# EAGLE design 4HP_2181_VCA (EAGLE 8.1.1)
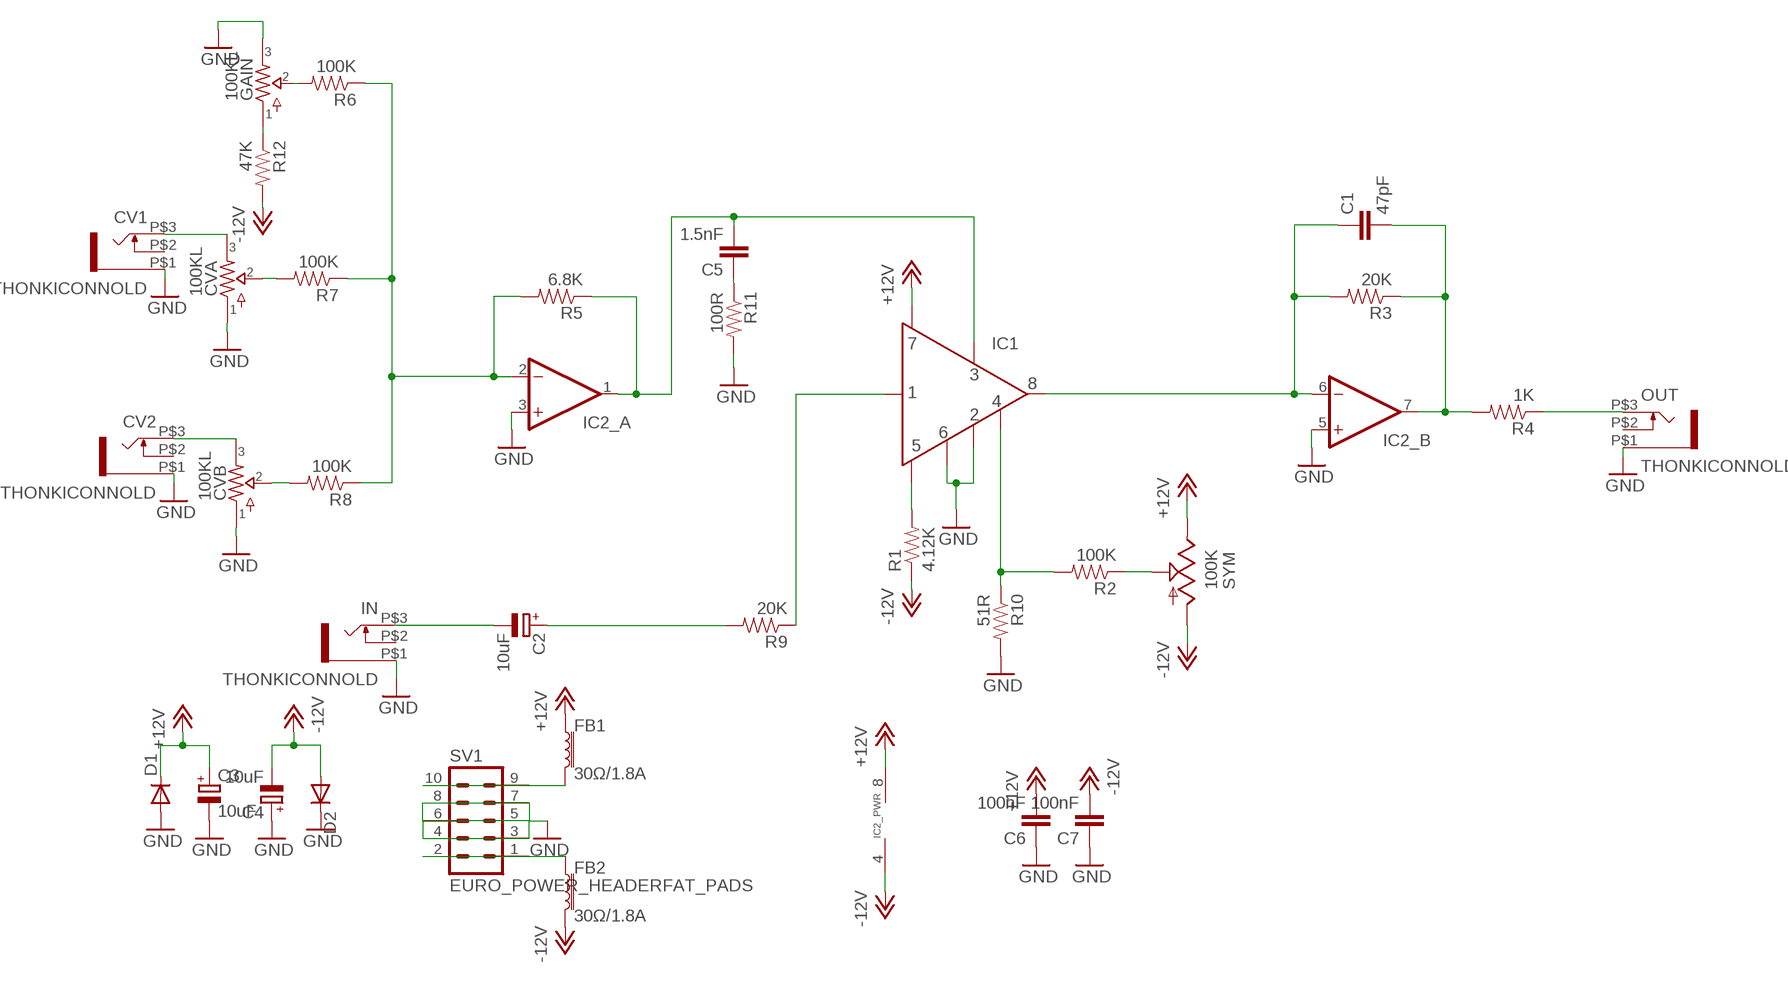
[diagram p0: schematic, sheet 1]

## Parts
C1  47pF  CAP0603-CAP  [0603-CAP]
C2  10uF  CAPACITOR_POL-CASE_B  [CASE_B]
C3  10uF  CAPACITOR_POL-CASE_B  [CASE_B]
C4  10uF  CAPACITOR_POL-CASE_B  [CASE_B]
C5  1.5nF  CAP0603-CAP  [0603-CAP]
C6  100nF  CAP0603-CAP  [0603-CAP]
C7  100nF  CAP0603-CAP  [0603-CAP]
CV1  THONKICONNOLD  [THONKICONN]
CV2  THONKICONNOLD  [THONKICONN]
CVA  100KL  POTS9MM_MOUNTED_2MMH  [9MM_W/MOUNTS-2MMHOLES]
CVB  100KL  POTS9MM_MOUNTED_2MMH  [9MM_W/MOUNTS-2MMHOLES]
D1  DIODE-SOD-123  [SOD-123]
D2  DIODE-SOD-123  [SOD-123]
FB1  30Ω/1.8A  FERRITE_BEAD-0603  [0603]
FB2  30Ω/1.8A  FERRITE_BEAD-0603  [0603]
GAIN  100KL  POTS9MM_MOUNTED_2MMH  [9MM_W/MOUNTS-2MMHOLES]
IC1  THAT2181C  [SIL8]
IC2  DUALSMD  [SO08]
IN  THONKICONNOLD  [THONKICONN]
OUT  THONKICONNOLD  [THONKICONN]
R1  4.12K  RESISTOR0603-RES  [0603-RES]
R2  100K  RESISTOR0603-RES  [0603-RES]
R3  20K  RESISTOR0603-RES  [0603-RES]
R4  1K  RESISTOR0603-RES  [0603-RES]
R5  6.8K  RESISTOR0603-RES  [0603-RES]
R6  100K  RESISTOR0603-RES  [0603-RES]
R7  100K  RESISTOR0603-RES  [0603-RES]
R8  100K  RESISTOR0603-RES  [0603-RES]
R9  20K  RESISTOR0603-RES  [0603-RES]
R10  51R  RESISTOR0603-RES  [0603-RES]
R11  100R  RESISTOR0603-RES  [0603-RES]
R12  47K  RESISTOR0603-RES  [0603-RES]
SV1  EURO_POWER_HEADERFAT_PADS  [EURO_PWR_HEADER_FAT]
SYM  100K  TRIM_US-S64W  [S64W]

## Nets
+12V: C3.+ C6.2 D1.C FB1.1 IC1.7 IC2.8(_PWR:V+) SYM.E
-12V: C4.- C7.2 D2.A FB2.2 IC2.4(_PWR:V-) R1.1 R12.2 SYM.A
GND: C3.- C4.+ C6.1 C7.1 CV1.P$1 CV2.P$1 CVA.P$1 CVB.P$1 D1.A D2.C GAIN.P$3 IC1.2 IC1.6 IC2.3(_A:+IN) IC2.5(_B:+IN) IN.P$1 OUT.P$1 R10.2 R11.2 SV1.3 SV1.4 SV1.5 SV1.6 SV1.7 SV1.8
N$1: C1.1 IC1.8 IC2.6(_B:-IN) R3.2
N$2: C5.2 IC1.3 IC2.1(_A:OUT) R5.1
N$3: IC1.5 R1.2
N$4: C1.2 IC2.7(_B:OUT) R3.1 R4.2
N$5: IC1.4 R2.2 R10.1
N$6: R2.1 SYM.S
N$7: OUT.P$3 R4.1
N$8: GAIN.P$2 R6.2
N$9: CVA.P$2 R7.2
N$10: CVB.P$2 R8.2
N$11: IC2.2(_A:-IN) R5.2 R6.1 R7.1 R8.1
N$12: C2.+ R9.2
N$13: C2.- IN.P$3
N$14: IC1.1 R9.1
N$15: CV1.P$3 CVA.P$3
N$16: CV2.P$3 CVB.P$3
N$17: FB1.2 SV1.9 SV1.10
N$18: FB2.1 SV1.1 SV1.2
N$19: C5.1 R11.1
N$20: GAIN.P$1 R12.1
Unconnected: CV1.P$2 CV2.P$2 IN.P$2 OUT.P$2

## Library data of the parts
C1 C5-C7 = SparkFun-Passives:CAP: Capacitor Standard 0603 ceramic capacitor, and 0.1" leaded capacitor.
C2-C4 = dp_devices:CAPACITOR_POL: Polarized capacitor in various packages
CV1 CV2 IN OUT = MusicThingModular:THONKICONN: 3.5mm socket for Eurorack modular synths
CVA CVB GAIN = potentiometers:POTS
D1 D2 = dp_devices:DIODE: Various Diode Packages
FB1 FB2 = SparkFun-Coils:FERRITE_BEAD: Ferrite Bead (blocks, cores, rings, chokes, etc.) Inductor with layers of ferrite used to suppress high frequencies. Often used to isolate high frequency noise. SparkFun Products: IOIO-OTG - V2.2 <https://www.sparkfun.com/products/13613> SparkFun SAMD21 Mini Breakout <https://www.sparkfun.com/products/13664> SparkFun 6 Degrees of Freedom Breakout - LSM6DS3 <https://www.sparkfun.com/products/13339> SparkFun SAMD21 Dev Breakout <https://www.sparkfun.com/products/13672>; PROD_ID: NDUC-07859
IC1 = integrated circuits:THAT2181C
IC2 = integrated circuits:DUAL: OP AMP
R1-R12 = SparkFun-Passives:RESISTOR: Resistor Basic schematic elements and footprints for 0603, 1206, and PTH resistors.
SV1 = MusicThingModular:EURO_POWER_HEADER: Power Header 10 pin power header for Eurorack Power Supplies Variants with fatter pads for easier soldering, and the LOCK variant which has 5mil offset pins to hold the component in place before soldering
SYM = pot:TRIM_US-: POTENTIOMETER

## Board
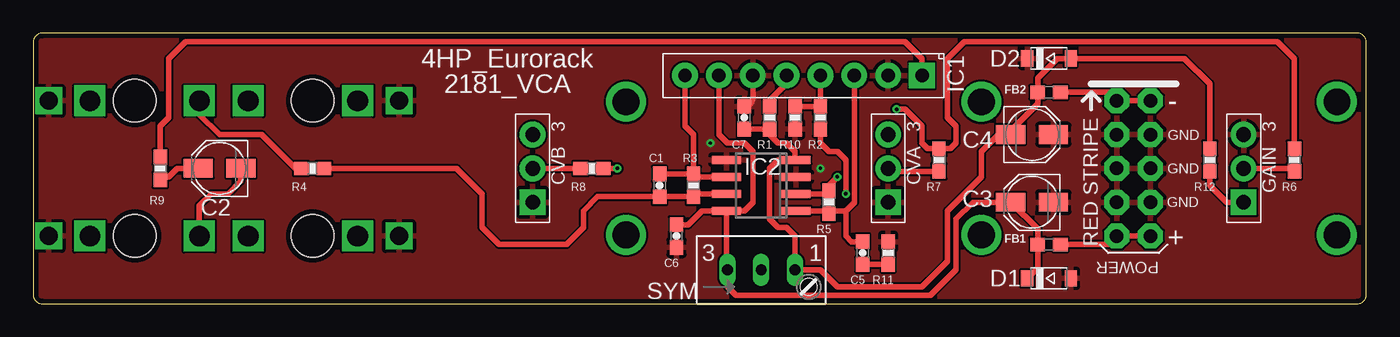
[diagram p1: board, top side]
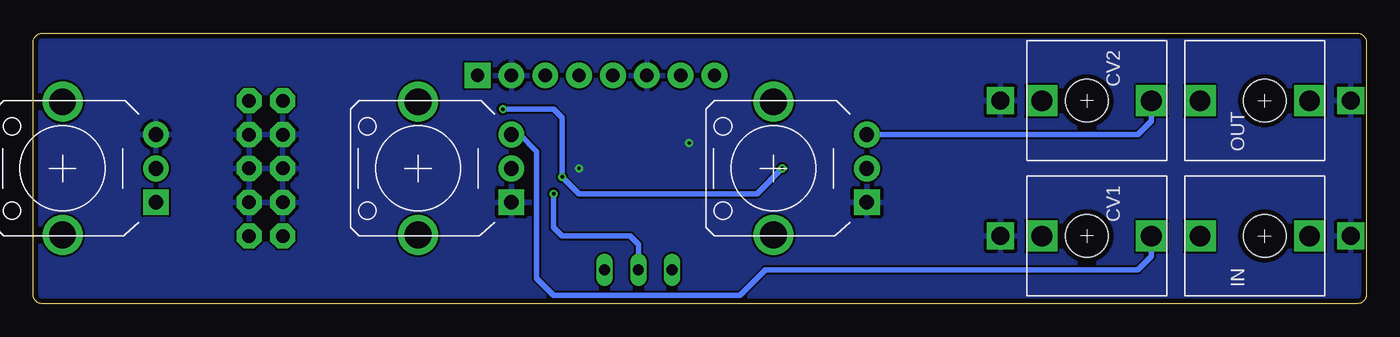
[diagram p2: board, bottom side, seen from below]

Size 100 x 20.31 mm. Coordinates in mm from the lower left corner, seen from the top.
Outline: 0,19.68 0,0.64 arc90 0.64,0 99.36,0 arc90 100,0.64 100,19.68 arc90 99.36,20.31 0.64,20.31 arc90 0,19.68
Copper layers (1*16): Top 0.0356mm / dielectric 1.5011mm / Bottom 0.0356mm
Design rules "LaenPCBOrder": minimum track width 6mil, minimum drill 13mil, track to track 6mil, track to pad 6mil, pad to pad 6mil, via to via 6mil, smd to smd 6mil, copper to edge 15mil, drill to drill 6mil, minimum pad ring 7mil, minimum via ring 7mil, stop-mask expansion 3mil, vias tented up to drill 0mil, thermal gap 10mil
Holes 3.2 mm at 7.62,15.24 20.95,15.24 20.95,5.08 7.62,5.08

### Footprints (pad centres in the part's own frame; a part is rotated, then mirrored left to right if it is on the bottom)
0603-CAP = smd 1.1 x 1: 1 -0.85,0; 2 0.85,0
CASE_B = smd 2.2 x 1.4: + 1.6,0; - -1.6,0
THONKICONN = drill 1.35 square: P$1 0,-6.48 | drill 1.55 square: P$2 0,-3.38; P$3 0,4.84
9MM_W/MOUNTS-2MMHOLES = drill 1.1 pad 1.93 square: P$1 2.54,0 | drill 1.1 pad 1.93: P$2 0,0; P$3 -2.54,0 | drill 2: P$4 -5,7; P$5 5,7
SOD-123 = smd 0.91 x 1.22: A 1.635,0; C -1.635,0
0603 = smd 1.1 x 1: 1 -0.85,0; 2 0.85,0
SIL8 = drill 1 pad 1.93 square: 1 -8.89,0 | drill 1 pad 1.93: 2 -6.35,0; 3 -3.81,0; 4 -1.27,0; 5 1.27,0; 6 3.81,0; 7 6.35,0; 8 8.89,0
SO08 = smd 0.6 x 2.2: 1 -1.905,-2.6; 2 -0.635,-2.6; 3 0.635,-2.6; 4 1.905,-2.6; 5 1.905,2.6; 6 0.635,2.6; 7 -0.635,2.6; 8 -1.905,2.6
0603-RES = smd 1.1 x 1: 1 -0.85,0; 2 0.85,0
EURO_PWR_HEADER_FAT = drill 1.016 pad 1.88 octagon: 1 -5.08,-1.27; 2 -5.08,1.27; 3 -2.54,-1.27; 4 -2.54,1.27; 5 0,-1.27; 6 0,1.27; 7 2.54,-1.27; 8 2.54,1.27; 9 5.08,-1.27; 10 5.08,1.27
S64W = drill 0.813 long: A 2.54,1.27; E -2.54,1.27; S 0,1.27

### Placement (x,y rotation side)
C1  46.99,8.89 270 top
C2  13.97,10.16 180 top
C3  74.93,7.62 180 top
C4  74.93,12.7 0 top
C5  62.23,3.81 90 top
C6  48.26,5.08 90 top
C7  53.34,13.97 270 top
CV1  20.95,5.08 270 bottom
CV2  20.95,15.24 270 bottom
CVA  64.14,10.16 270 top
CVB  37.47,10.16 270 top
D1  76.2,1.91 0 top
D2  76.2,18.41 0 top
FB1  76.2,4.45 0 top
FB2  76.2,15.88 180 top
GAIN  90.81,10.16 270 top
IC1  57.78,17.14 180 top
IC2  54.61,8.89 90 top
IN  7.62,5.08 90 bottom
OUT  7.62,15.24 90 bottom
R1  55.24,13.97 90 top
R2  59.05,13.97 90 top
R3  49.53,8.89 90 top
R4  20.95,10.16 0 top
R5  59.69,7.62 90 top
R6  94.61,10.79 270 top
R7  67.94,10.79 270 top
R8  41.91,10.16 180 top
R9  9.53,10.16 270 top
R10  57.15,13.97 270 top
R11  64.14,3.81 90 top
R12  88.27,10.79 90 top
SV1  82.55,10.16 270 top
SYM  54.61,1.27 0 top

### Tracks (layer width: path | path; a pad name or v marks a point on that pad's centre or on a via)
+12V
  Top 0.254: 52.01,2.6 SYM.E
  Top 0.406: IC2.8 52.01,2.6 | IC2.8 53.34,6.99 53.98,7.62 53.98,11.43 53.34,12.06 52.07,12.06 51.44,12.7 IC1.7 | D1.C 75.35,2.69 FB1.1 75.35,5.6 C3.+ 70.48,7.62 69.22,6.35 69.22,2.54 67.31,0.64 52.7,0.64 52.07,1.27 SYM.E | IC2.8 50.16,6.99 49.11,5.93 C6.2
-12V
  Top 0.254: 57.15,10.86 IC2.4
  Top 0.406: IC2.4 55.88,10.79 55.24,10.16 55.24,6.35 55.88,5.71 56.52,5.71 57.15,5.08 SYM.A 59.05,2.54 60.33,1.27 66.67,1.27 68.58,3.17 68.58,6.99 71.12,9.53 71.12,11.43 72.39,12.7 C4.- 73.33,13.01 75.35,15.03 FB2.2 75.35,16.93 76.83,18.41 D2.A 86.36,18.41 88.27,16.51 R12.2 | 57.15,10.86 57.15,11.43 56.52,12.06 55.88,12.06 55.24,12.7 R1.1 C7.2
GND  (via drill 0.25)
  Top 0.406: C7.1 arc90 53.98,15.46 IC1.6
  other vias: 50.8,12.06 59.05,10.16
  pour Bottom: -3.81,26.67 107.95,26.67 107.95,-10.16 -3.81,-10.16
  pour Top: -7.62,-16.51 104.14,-16.51 104.14,22.86 -7.62,22.86
N$1
  Top 0.254: 49.74,9.53 R3.2
  Top 0.406: IC2.6 49.74,9.53 | C1.1 R3.2 49.53,12.7 48.9,13.34 IC1.8
N$2
  Top 0.254: 59.48,6.99 R5.1
  Top 0.406: IC2.1 59.48,6.99 60.96,6.99 | 60.96,6.99 61.59,7.62 IC1.3 | C5.2 61.38,4.66 60.96,5.08 60.96,6.99
N$3
  Top 0.406: IC1.5 56.52,16.51 55.24,15.24 R1.2
N$4
  Top 0.254: 49.74,8.26 R3.1
  Top 0.406: IC2.7 49.74,8.26 | R3.1 C1.2 42.33,8.04 41.27,6.99 41.27,5.71 40.01,4.45 34.92,4.45 33.66,5.71 33.66,8.26 31.75,10.16 R4.2
N$5
  Top 0.406: IC1.4 R2.2 R10.1
N$6  (via drill 0.25)
  Top 0.406: R2.1 59.05,12.06 59.69,11.43 60.33,11.43 60.96,10.79 v60.96,8.26
  Bottom 0.406: v60.96,8.26 60.96,5.71 60.33,5.08 55.24,5.08 54.61,4.45 SYM.S
N$7
  Top 0.406: OUT.P$3 12.46,14.21 13.97,12.7 17.14,12.7 19.68,10.16 R4.1
N$8
  Top 0.254: 94.4,10.16 R6.2
  Top 0.406: GAIN.P$2 94.4,10.16
N$9
  Top 0.254: CVA.P$2 64.35,9.95
  Top 0.406: 64.35,9.95 R7.2
N$10
  Top 0.406: CVB.P$2 R8.2
N$11  (via drill 0.25)
  Top 0.254: 59.48,8.26 R5.2
  Top 0.406: IC2.2 59.48,8.26 | v60.33,9.53 59.69,8.89 R5.2 | R8.1 v43.81,10.16 | R6.1 94.61,18.41 93.34,19.68 69.85,19.68 68.58,18.41 68.58,13.97 69.22,13.34 69.22,12.06 68.8,11.64 R7.1 67.09,11.64 66.67,12.06 66.67,13.34 65.41,14.61 v64.77,14.61
  Bottom 0.406: v43.81,10.16 45.72,8.26 59.05,8.26 v60.33,9.53 60.33,13.97 60.96,14.61 v64.77,14.61
N$12
  Top 0.406: C2.+ 10.79,10.16 10.16,9.53 9.74,9.53 R9.2
N$13
  Top 0.254: 12.37,5.17 IN.P$3
  Top 0.406: C2.- 15.57,9.22 14.61,8.26 13.34,8.26 12.46,7.38 IN.P$3
N$14
  Top 0.406: R9.1 9.53,13.34 10.16,13.97 10.16,18.41 11.43,19.68 65.41,19.68 66.67,18.41 IC1.1
N$15
  Bottom 0.406: CV1.P$3 16.11,3.57 17.14,2.54 45.09,2.54 46.99,0.64 60.96,0.64 62.23,1.91 62.23,11.43 63.5,12.7 CVA.P$3
N$16
  Bottom 0.406: CV2.P$3 16.11,13.73 17.14,12.7 18.41,12.7 CVB.P$3
N$17
  Top 0.406: SV1.10 SV1.9 80.64,4.45 FB1.2
N$18
  Top 0.406: SV1.2 SV1.1 80.64,15.88 FB2.1
N$19
  Top 0.406: C5.1 R11.1
N$20
  Top 0.406: GAIN.P$1 89.53,7.62 88.27,8.89 R12.1

### Text on the board
tPlace: 4HP_Eurorack | 2181_VCA